# EAGLE schematic proiect (EAGLE 9.6.2)
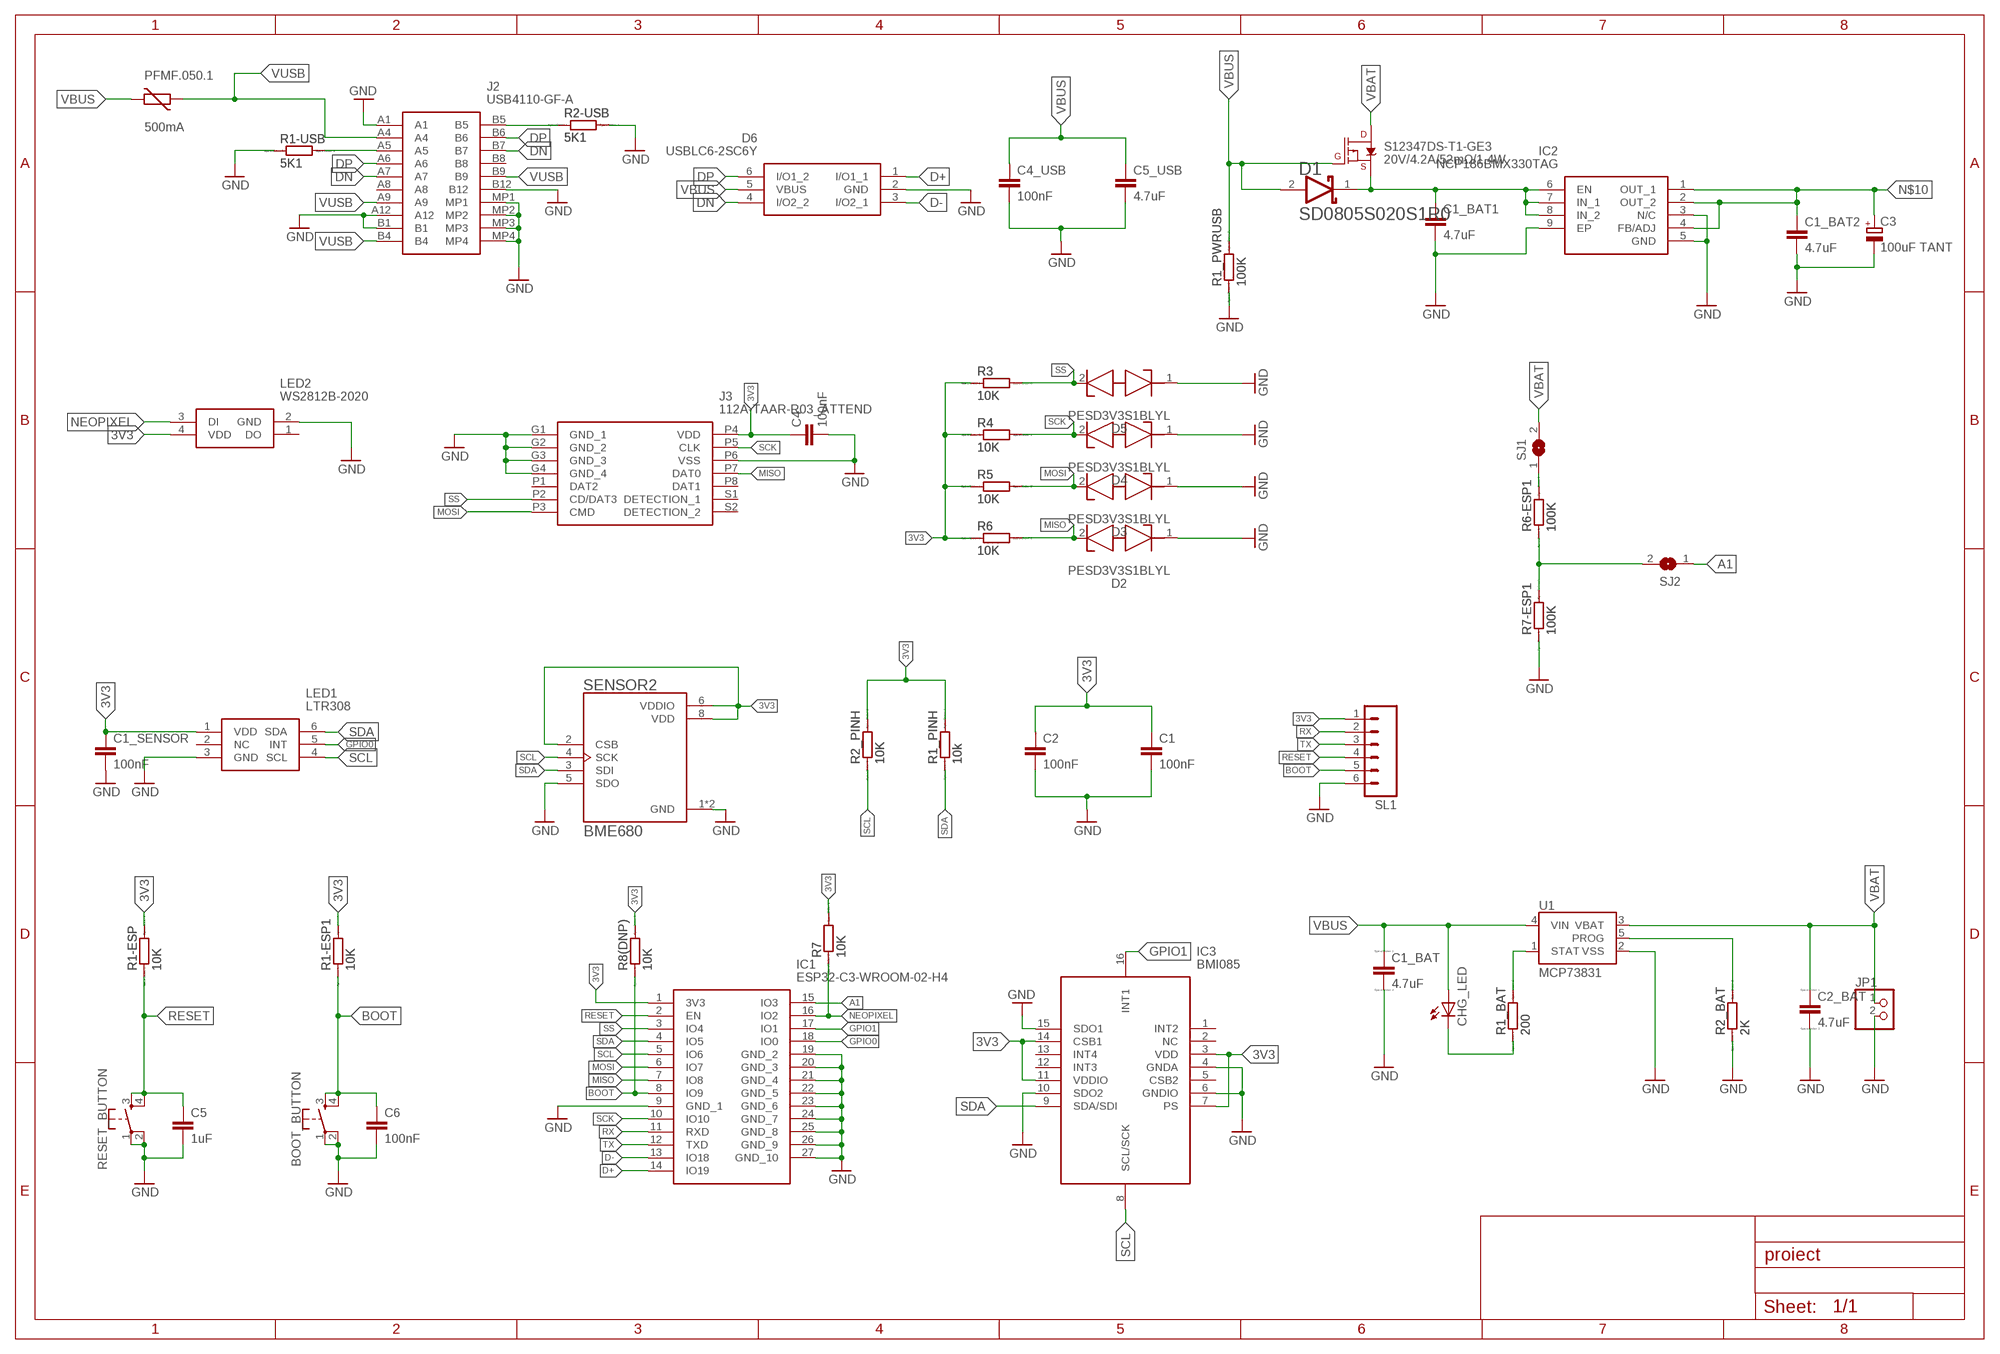
[diagram p0: schematic, sheet 1]

## Parts
BOOT_BUTTON  ESP32_WROVER_SPARKFUN-SWITCHES_MOMENTARY-SWITCH-SPST-2-SMD-4.6X2.8MM  [ESP32_WROVER_SPARKFUN-SWITCHES_TACTILE_SWITCH_SMD_4.6X2.8MM]
C1  100nF  ESP32_WROVER_RCL_C-EUC0603  [ESP32_WROVER_RCL_C0603]
C1_BAT  4.7uF  ESP32_WROVER_EAGLE-LTSPICE_CC0402  [ESP32_WROVER_EAGLE-LTSPICE_C0402]
C1_BAT1  4.7uF  ESP32_WROVER_RCL_C-EUC0603  [ESP32_WROVER_RCL_C0603]
C1_BAT2  4.7uF  ESP32_WROVER_RCL_C-EUC0603  [ESP32_WROVER_RCL_C0603]
C1_SENSOR  100nF  ESP32_WROVER_RCL_C-EUC0603  [ESP32_WROVER_RCL_C0603]
C2  100nF  ESP32_WROVER_RCL_C-EUC0603  [ESP32_WROVER_RCL_C0603]
C2_BAT  4.7uF  ESP32_WROVER_EAGLE-LTSPICE_CC0402  [ESP32_WROVER_EAGLE-LTSPICE_C0402]
C3  100uF TANT  RCL_CPOL-EUCT3528  [RCL_CT3528]
C4  100nF  ESP32_WROVER_RCL_C-EUC0603  [ESP32_WROVER_RCL_C0603]
C4_USB  100nF  ESP32_WROVER_RCL_C-EUC0603  [ESP32_WROVER_RCL_C0603]
C5  1uF  ESP32_WROVER_RCL_C-EUC0603  [ESP32_WROVER_RCL_C0603]
C5_USB  4.7uF  ESP32_WROVER_RCL_C-EUC0603  [ESP32_WROVER_RCL_C0603]
C6  100nF  ESP32_WROVER_RCL_C-EUC0603  [ESP32_WROVER_RCL_C0603]
CHG_LED  ESP32_WROVER_ADAFRUIT_LEDCHIP-LED0603  [ESP32_WROVER_ADAFRUIT_CHIP-LED0603]
D1  ESP32_WROVER_AVX---SD0805S020S1R0_AVX_SD0805S020S1R0AVX_SD0805S020S1R0_0_0  [ESP32_WROVER_AVX---SD0805S020S1R0_AVX_SD0805S020S1R0_0]
D2  PESD3V3S1BLYL  SAMACSYS_PARTS_PESD3V3S1BLYL  [SAMACSYS_PARTS_PESD5V0S1BL315]
D3  PESD3V3S1BLYL  SAMACSYS_PARTS_PESD3V3S1BLYL  [SAMACSYS_PARTS_PESD5V0S1BL315]
D4  PESD3V3S1BLYL  SAMACSYS_PARTS_PESD3V3S1BLYL  [SAMACSYS_PARTS_PESD5V0S1BL315]
D5  PESD3V3S1BLYL  SAMACSYS_PARTS_PESD3V3S1BLYL  [SAMACSYS_PARTS_PESD5V0S1BL315]
D6  USBLC6-2SC6Y  SAMACSYS_PARTS_USBLC6-2SC6Y  [SAMACSYS_PARTS_SOT95P280X145-6N]
IC1  ESP32-C3-WROOM-02-H4  SAMACSYS_PARTS_ESP32-C3-WROOM-02-H4  [SAMACSYS_PARTS_ESP32C3WROOM02H4]
IC2  NCP186BMX330TAG  SAMACSYS_PARTS_NCP186BMX330TAG  [SAMACSYS_PARTS_NCP186AMX330TAG]
IC3  BMI085  SAMACSYS_PARTS_BMI085  [SAMACSYS_PARTS_BMI085]
J2  USB4110-GF-A  SAMACSYS_PARTS_USB4110-GF-A  [SAMACSYS_PARTS_USB4110GFA]
J3  112A-TAAR-R03_ATTEND  SAMACSYS_PARTS_112A-TAAR-R03_ATTEND  [SAMACSYS_PARTS_112ATAARR03ATTEND]
JP1  PINHEAD_PINHD-1X2  [PINHEAD_1X02]
LED1  LTR308  ESP32_WROVER_SAMACSYS_PARTS_LTR-303ALS-01  [ESP32_WROVER_SAMACSYS_PARTS_LTR303ALS01]
LED2  WS2812B-2020  SAMACSYS_PARTS_WS2812B-2020  [SAMACSYS_PARTS_WS2812B2020]
PFMF.050.1  500mA  ESP32_WROVER_VARISTOR_VARISTORCN1812  [ESP32_WROVER_VARISTOR_CT/CN1812]
R1-ESP  10K  ESP32_WROVER_EAGLE-LTSPICE_RR0402  [ESP32_WROVER_EAGLE-LTSPICE_R0402]
R1-ESP1  10K  ESP32_WROVER_EAGLE-LTSPICE_RR0402  [ESP32_WROVER_EAGLE-LTSPICE_R0402]
R1-USB  5K1  ESP32_WROVER_EAGLE-LTSPICE_RR0402  [ESP32_WROVER_EAGLE-LTSPICE_R0402]
R1_BAT  200  ESP32_WROVER_EAGLE-LTSPICE_RR0402  [ESP32_WROVER_EAGLE-LTSPICE_R0402]
R1_PINH  10k  ESP32_WROVER_EAGLE-LTSPICE_RR0402  [ESP32_WROVER_EAGLE-LTSPICE_R0402]
R1_PWRUSB  100K  ESP32_WROVER_EAGLE-LTSPICE_RR0402  [ESP32_WROVER_EAGLE-LTSPICE_R0402]
R2-USB  5K1  ESP32_WROVER_EAGLE-LTSPICE_RR0402  [ESP32_WROVER_EAGLE-LTSPICE_R0402]
R2_BAT  2K  ESP32_WROVER_EAGLE-LTSPICE_RR0402  [ESP32_WROVER_EAGLE-LTSPICE_R0402]
R2_PINH  10K  ESP32_WROVER_EAGLE-LTSPICE_RR0402  [ESP32_WROVER_EAGLE-LTSPICE_R0402]
R3  10K  ESP32_WROVER_EAGLE-LTSPICE_RR0402  [ESP32_WROVER_EAGLE-LTSPICE_R0402]
R4  10K  ESP32_WROVER_EAGLE-LTSPICE_RR0402  [ESP32_WROVER_EAGLE-LTSPICE_R0402]
R5  10K  ESP32_WROVER_EAGLE-LTSPICE_RR0402  [ESP32_WROVER_EAGLE-LTSPICE_R0402]
R6  10K  ESP32_WROVER_EAGLE-LTSPICE_RR0402  [ESP32_WROVER_EAGLE-LTSPICE_R0402]
R6-ESP1  100K  ESP32_WROVER_EAGLE-LTSPICE_RR0402  [ESP32_WROVER_EAGLE-LTSPICE_R0402]
R7  10K  ESP32_WROVER_EAGLE-LTSPICE_RR0402  [ESP32_WROVER_EAGLE-LTSPICE_R0402]
R7-ESP1  100K  ESP32_WROVER_EAGLE-LTSPICE_RR0402  [ESP32_WROVER_EAGLE-LTSPICE_R0402]
R8(DNP)  10K  ESP32_WROVER_EAGLE-LTSPICE_RR0402  [ESP32_WROVER_EAGLE-LTSPICE_R0402]
RESET_BUTTON  ESP32_WROVER_SPARKFUN-SWITCHES_MOMENTARY-SWITCH-SPST-2-SMD-4.6X2.8MM  [ESP32_WROVER_SPARKFUN-SWITCHES_TACTILE_SWITCH_SMD_4.6X2.8MM]
S12347DS-T1-GE3  20V/4.2A/52mΩ/1.4W  ESP32_WROVER_SPARKFUN-DISCRETESEMI_MOSFET_PCH-DMG2305UX-7  [ESP32_WROVER_SPARKFUN-DISCRETESEMI_SOT23-3]
SENSOR2  BME680  ESP32_WROVER_BME680_BME680  [ESP32_WROVER_BME680_PSON80P300X300X100-8N]
SJ1  JUMPER_SJ  [JUMPER_SJ]
SJ2  JUMPER_SJ  [JUMPER_SJ]
SL1  MA06  [06PA]
U1  MCP73831  ESP32_WROVER_SPARKFUN-IC-POWER_MCP73831  [ESP32_WROVER_SPARKFUN-IC-POWER_SOT23-5]

## Nets
3V3: C1.1 C1_SENSOR.1 C2.1 C4.1 IC1.1(3V3) IC3.3(VDD) IC3.7(PS) IC3.11(VDDIO) IC3.14(CSB1) J3.P4(VDD) LED1.1(VDD) LED2.4(VDD) R1-ESP1.2 R1-ESP.2 R1_PINH.2 R2_PINH.2 R3.1 R4.1 R5.1 R6.1 R7.2 R8(DNP).2 SENSOR2.2(CSB) SENSOR2.6(VDDIO) SENSOR2.8(VDD) SL1.1
A1: IC1.15(IO3) SJ2.1
BOOT: BOOT_BUTTON.3 BOOT_BUTTON.4 C6.1 IC1.8(IO9) R1-ESP1.1 R8(DNP).1 SL1.5
D+: D6.1(I/O1_1) IC1.14(IO19)
D-: D6.3(I/O2_1) IC1.13(IO18)
DN: D6.4(I/O2_2) J2.A7 J2.B7
DP: D6.6(I/O1_2) J2.A6 J2.B6
GND: BOOT_BUTTON.1 BOOT_BUTTON.2 C1.2 C1_BAT1.2 C1_BAT2.2 C1_BAT.2 C1_SENSOR.2 C2.2 C2_BAT.2 C3.- C4.2 C4_USB.2 C5.2 C5_USB.2 C6.2 D2.1(K1) D3.1(K1) D4.1(K1) D5.1(K1) D6.2(GND) IC1.9(GND_1) IC1.19(GND_2) IC1.20(GND_3) IC1.21(GND_4) IC1.22(GND_5) IC1.23(GND_6) IC1.24(GND_7) IC1.25(GND_8) IC1.26(GND_9) IC1.27(GND_10) IC2.3(N/C) IC2.5(GND) IC2.9(EP) IC3.4(GNDA) IC3.6(GNDIO) IC3.10(SDO2) IC3.15(SDO1) J2.A1 J2.A12 J2.B1 J2.B12 J2.MP1 J2.MP2 J2.MP3 J2.MP4 J3.G1(GND_1) J3.G2(GND_2) J3.G3(GND_3) J3.G4(GND_4) J3.P6(VSS) JP1.2 LED1.3(GND) LED2.2(GND) R1-USB.1 R1_PWRUSB.1 R2-USB.2 R2_BAT.1 R7-ESP1.1 RESET_BUTTON.1 RESET_BUTTON.2 SENSOR2.1(GND) SENSOR2.5(SDO) SENSOR2.7(GND) SL1.6 U1.2(VSS)
GPIO0: IC1.18(IO0) LED1.5(INT)
GPIO1: IC1.17(IO1) IC3.16(INT1)
MISO: D2.2(K2) IC1.7(IO8) J3.P7(DAT0) R6.2
MOSI: D3.2(K2) IC1.6(IO7) J3.P3(CMD) R5.2
N$1: C1_BAT1.1 D1.1(CATHODE) IC2.6(EN) IC2.7(IN_1) IC2.8(IN_2) S12347DS-T1-GE3.2(S)
N$2: R2_BAT.2 U1.5(PROG)
N$3: R1_BAT.2 U1.1(STAT)
N$4: J2.B5 R2-USB.1
N$5: R6-ESP1.2 SJ1.1
N$6: J2.A5 R1-USB.2
N$7: R6-ESP1.1 R7-ESP1.2 SJ2.2
N$8: CHG_LED.C R1_BAT.1
N$10: C1_BAT2.1 C3.+ IC2.1(OUT_1) IC2.2(OUT_2) IC2.4(FB/ADJ)
NEOPIXEL: IC1.16(IO2) LED2.3(DI) R7.1
RESET: C5.1 IC1.2(EN) R1-ESP.1 RESET_BUTTON.3 RESET_BUTTON.4 SL1.4
RX: IC1.11(RXD) SL1.2
SCK: D4.2(K2) IC1.10(IO10) J3.P5(CLK) R4.2
SCL: IC1.5(IO6) IC3.8(SCL/SCK) LED1.4(SCL) R2_PINH.1 SENSOR2.4(SCK)
SDA: IC1.4(IO5) IC3.9(SDA/SDI) LED1.6(SDA) R1_PINH.1 SENSOR2.3(SDI)
SS: D5.2(K2) IC1.3(IO4) J3.P2(CD/DAT3) R3.2
TX: IC1.12(TXD) SL1.3
VBAT: C2_BAT.1 JP1.1 S12347DS-T1-GE3.3(D) SJ1.2 U1.3(VBAT)
VBUS: C1_BAT.1 C4_USB.1 C5_USB.1 CHG_LED.A D1.2(ANODE) D6.5(VBUS) PFMF.050.1.2 R1_PWRUSB.2 S12347DS-T1-GE3.1(G) U1.4(VIN)
VUSB: J2.A4 J2.A9 J2.B4 J2.B9 PFMF.050.1.1
Unconnected: IC3.1(INT2) IC3.2(NC) IC3.5(CSB2) IC3.12(INT3) IC3.13(INT4) J2.A8 J2.B8 J3.P1(DAT2) J3.P8(DAT1) J3.S1(DETECTION_1) J3.S2(DETECTION_2) LED1.2(NC) LED2.1(DO)

## Library data of the parts
BOOT_BUTTON RESET_BUTTON = ESP32_C3_Sparrow:ESP32_WROVER_SPARKFUN-SWITCHES_MOMENTARY-SWITCH-SPST-2: Momentary Switch (Pushbutton) - SPST - Two Circuits Normally-open (NO) SPST momentary switches (buttons, pushbuttons). Schematic symbol includes two switch circuits. Variants SMD-4.6MMX2.8MM - 4.60mm x 2.80mm Tactile Momentary Button Switch - Used on SparkFun SAMD21 Mini Breakout <https://www.sparkfun.com/products/13664> SMD-5.2MM - Mini Pushbutton Switch - SMD <https://www.sparkfun.com/products/8720> - Used on Arduino Pro Mini <https://www.sparkfun.com/products/11114>; PROD_ID: SWCH-14139; SF_SKU: COM-08720
C1 C1_BAT1 C1_BAT2 C1_SENSOR C2 C4 C4_USB C5 C5_USB C6 = ESP32_C3_Sparrow:ESP32_WROVER_RCL_C-EU: CAPACITOR, European symbol; SPICEPREFIX: C
C1_BAT C2_BAT = ESP32_C3_Sparrow:ESP32_WROVER_EAGLE-LTSPICE_C: CAPACITOR, European symbol; SPICEMODEL: NONE; SPICEPREFIX: C
C3 = ESP32_C3_Sparrow:RCL_CPOL-EU: POLARIZED CAPACITOR, European symbol; SPICEPREFIX: C
CHG_LED = ESP32_C3_Sparrow:ESP32_WROVER_ADAFRUIT_LED: LED OSRAM: - CHIPLED LG R971, LG N971, LY N971, LG Q971, LY Q971, LO R971, LY R971 LH N974, LH R974 LS Q976, LO Q976, LY Q976 LO Q996 - Hyper CHIPLED LW Q18S LB Q993, LB Q99A, LB R99A - SideLED LS A670, LO A670, LY A670, LG A670, LP A670 LB A673, LV A673, LT A673, LW A673 LH A674 LY A675 LS A676, LA A676, LO A676, LY A676, LW A676 LS A679, LY A679, LG A679 - Hyper Micro SIDELED® LS Y876, LA Y876, LO Y876, LY Y876 LT Y87S - SmartLED LW L88C, LW L88S LB L89C, LB L89S, LG L890 LS L89K, LO L89K, LY L89K LS L896, LA L896, LO L896, LY L896 - TOPLED LS T670, LO T670, LY T670, LG T670, LP T670 LSG T670, LSP T670, LSY T670, LOP T670, LYG T670 LG T671, LOG T671, LSG T671 LB T673, LV T673, LT T673, LW T673 LH T674 LS T676, LA T676, LO T676, LY T676, LB T676, LH T676, LSB T676, LW T676 LB T67C, LV T67C, LT T67C, LS T67K, LO T67K, LY T67K, LW E67C LS E67B, LA E67B, LO E67B, LY E67B, LB E67C, LV E67C, LT E67C LW T67C LS T679, LY T679, LG T679 LS T770, LO T770, LY T770, LG T770, LP T770 LB T773, LV T773, LT T773, LW T773 LH T774 LS E675, LA E675, LY E675, LS T675 LS T776, LA T776, LO T776, LY T776, LB T776 LHGB T686 LT T68C, LB T68C - Hyper Mini TOPLED® LB M676 - Mini TOPLED Santana® LG M470 LS M47K, LO M47K, LY M47K Source: http://www.osram.convergy.de/
D1 = ESP32_C3_Sparrow:ESP32_WROVER_AVX---SD0805S020S1R0_AVX_SD0805S020S1R0: Schottky Barrier Rectifier Diode; CENTROID_NOT_SPECIFIED: No; DATASHEET: http://datasheets.avx.com/schottky.pdf; DIGIKEY_DESCRIPTION: DIODE SCHOTTKY 20V 1A 0805; DIGIKEY_PART_NUMBER: 478-7800-1-ND; LEAD_FREE: yes; MF: AVX; MOUSER_PART_NUMBER: 581-SD0805S020S1R0; MPN: SD0805S020S1R0; PACKAGE: 0805 (2012 metric); PREFIX: D; ROHS: yes; TEMPERATURE_RANGE_HIGH: +125°C; TEMPERATURE_RANGE_LOW: -55°C
D2-D5 = ESP32_C3_Sparrow:SAMACSYS_PARTS_PESD3V3S1BLYL: PESD3V3S1BL - Low capacitance bidirectional ESD protection diode Source: Datasheet <https://assets.nexperia.com/documents/data-sheet/PESD3V3S1BL.pdf>; ARROW_PART_NUMBER: PESD3V3S1BLYL; ARROW_PRICE-STOCK: https://www.arrow.com/en/products/pesd3v3s1blyl/nexperia?region=nac; DESCRIPTION: PESD3V3S1BL - Low capacitance bidirectional ESD protection diode; HEIGHT: 0mm; MANUFACTURER_NAME: Nexperia; MANUFACTURER_PART_NUMBER: PESD3V3S1BLYL; MOUSER_PART_NUMBER: 771-PESD3V3S1BLYL; MOUSER_PRICE-STOCK: https://www.mouser.co.uk/ProductDetail/Nexperia/PESD3V3S1BLYL?qs=vLWxofP3U2zWoKHYJMVoKQ%3D%3D
D6 = ESP32_C3_Sparrow:SAMACSYS_PARTS_USBLC6-2SC6Y: Low Cap. ESD Protection Auto SOT-23-6 STMicroelectronics USBLC6-2SC6Y, Dual Uni-Directional TVS Diode Array, 6-Pin SOT-23 Source: Datasheet <https://componentsearchengine.com/Datasheets/1/USBLC6-2SC6Y.pdf>; ARROW_PART_NUMBER: USBLC6-2SC6Y; ARROW_PRICE-STOCK: https://www.arrow.com/en/products/usblc6-2sc6y/stmicroelectronics?region=nac; DESCRIPTION: Low Cap. ESD Protection Auto SOT-23-6 STMicroelectronics USBLC6-2SC6Y, Dual Uni-Directional TVS Diode Array, 6-Pin SOT-23; HEIGHT: 1.45mm; MANUFACTURER_NAME: STMicroelectronics; MANUFACTURER_PART_NUMBER: USBLC6-2SC6Y; MOUSER_PART_NUMBER: 511-USBLC6-2SC6Y; MOUSER_PRICE-STOCK: https://www.mouser.co.uk/ProductDetail/STMicroelectronics/USBLC6-2SC6Y?qs=gNDSiZmRJS%2FOgDexvXkdow%3D%3D
IC1 = ESP32_C3_Sparrow:SAMACSYS_PARTS_ESP32-C3-WROOM-02-H4: WiFi Modules (802.11) SMD module, ESP32-C3, 4MB SPI flash, PCB antenna, -40 C +105 C Source: Datasheet <https://www.mouser.in/datasheet/2/891/Espressif_Systems_04082021_ESP32_C3_WROOM_02-2295851.pdf>; DESCRIPTION: WiFi Modules (802.11) SMD module, ESP32-C3, 4MB SPI flash, PCB antenna, -40 C +105 C; HEIGHT: 3.35mm; MANUFACTURER_NAME: Espressif Systems; MANUFACTURER_PART_NUMBER: ESP32-C3-WROOM-02-H4; MOUSER_PART_NUMBER: 356-ESP32C3WROOM02H4; MOUSER_PRICE-STOCK: https://www.mouser.co.uk/ProductDetail/Espressif-Systems/ESP32-C3-WROOM-02-H4?qs=stqOd1AaK79%2FSA14oWtR%252Bw%3D%3D
IC2 = ESP32_C3_Sparrow:SAMACSYS_PARTS_NCP186BMX330TAG: LDO Voltage Regulators FAST TRANSIENT RESPO Source: Datasheet <http://www.onsemi.com/pub/Collateral/NCP186-D.PDF>; ARROW_PART_NUMBER: NCP186BMX330TAG; ARROW_PRICE-STOCK: https://www.arrow.com/en/products/ncp186bmx330tag/on-semiconductor?region=nac; DESCRIPTION: LDO Voltage Regulators FAST TRANSIENT RESPO; HEIGHT: mm; MANUFACTURER_NAME: onsemi; MANUFACTURER_PART_NUMBER: NCP186BMX330TAG; MOUSER_PART_NUMBER: 863-NCP186BMX330TAG; MOUSER_PRICE-STOCK: https://www.mouser.co.uk/ProductDetail/onsemi/NCP186BMX330TAG?qs=tCMd4XlZ%2FiDuLBXmI4EY0w%3D%3D
IC3 = ESP32_C3_Sparrow:SAMACSYS_PARTS_BMI085: IMUs - Inertial Measurement Units High-performance IMU BMI085 for virtual and augmented reality applications Source: Datasheet <https://ae-bst.resource.bosch.com/media/_tech/media/datasheets/BST-BMI085-DS001.pdf>; ARROW_PART_NUMBER: BMI085; ARROW_PRICE-STOCK: https://www.arrow.com/en/products/bmi085/bosch; DESCRIPTION: IMUs - Inertial Measurement Units High-performance IMU BMI085 for virtual and augmented reality applications; HEIGHT: 1mm; MANUFACTURER_NAME: BOSCH; MANUFACTURER_PART_NUMBER: BMI085; MOUSER_PART_NUMBER: 262-BMI085; MOUSER_PRICE-STOCK: https://www.mouser.co.uk/ProductDetail/Bosch-Sensortec/BMI085?qs=y6ZabgHbY%252ByGCM8LfWZyqA%3D%3D
J2 = ESP32_C3_Sparrow:SAMACSYS_PARTS_USB4110-GF-A: CONN USB 2.0 TYPE-C R/A SMT Source: Datasheet <https://gct.co/files/drawings/usb4110.pdf>; DESCRIPTION: CONN USB 2.0 TYPE-C R/A SMT; HEIGHT: 3.26mm; MANUFACTURER_NAME: GCT (GLOBAL CONNECTOR TECHNOLOGY); MANUFACTURER_PART_NUMBER: USB4110-GF-A; MOUSER_PART_NUMBER: 640-USB4110-GF-A; MOUSER_PRICE-STOCK: https://www.mouser.co.uk/ProductDetail/GCT/USB4110-GF-A?qs=KUoIvG%2F9IlYiZvIXQjyJeA%3D%3D
J3 = ESP32_C3_Sparrow:SAMACSYS_PARTS_112A-TAAR-R03_ATTEND: Micro SD Card Socket, Push-Push Type, Top Mount, SMT, H=1.83mm, 10u Source: Datasheet <https://www.attend.com.tw/data/download/file/112A-TAAR-R03.pdf>; DESCRIPTION: Micro SD Card Socket, Push-Push Type, Top Mount, SMT, H=1.83mm, 10u; HEIGHT: 1.9mm; MANUFACTURER_NAME: ATTEND; MANUFACTURER_PART_NUMBER: 112A-TAAR-R03 ATTEND
JP1 = ESP32_C3_Sparrow:PINHEAD_PINHD-1X2: PIN HEADER
LED1 = ESP32_C3_Sparrow:ESP32_WROVER_SAMACSYS_PARTS_LTR-303ALS-01: Ambient Light Sensors Ambient Light Photo Sensor Source: Datasheet <http://optoelectronics.liteon.com/upload/download/DS86-2013-0004/LTR-303ALS-01_DS_V1.pdf>; ARROW_PART_NUMBER: LTR-303ALS-01; ARROW_PRICE-STOCK: https://www.arrow.com/en/products/ltr-303als-01/lite-on-technology?region=nac; DESCRIPTION: Ambient Light Sensors Ambient Light Photo Sensor; HEIGHT: 0mm; MANUFACTURER_NAME: Lite-On; MANUFACTURER_PART_NUMBER: LTR-303ALS-01; MOUSER_PART_NUMBER: 859-LTR-303ALS-01; MOUSER_PRICE-STOCK: https://www.mouser.co.uk/ProductDetail/Lite-On/LTR-303ALS-01?qs=Ml%2FaxAEbwm%252Bm%252BetMkBDC8g%3D%3D
LED2 = ESP32_C3_Sparrow:SAMACSYS_PARTS_WS2812B-2020: LED; SMD; 2020; RGB; 2x2x0.84mm; 3.75.3V; Lens: transparent; 2kHz Source: Datasheet <https://www.alldatasheet.com/datasheet-pdf/pdf/1134522/WORLDSEMI/WS2812B-2020.html>; DESCRIPTION: LED; SMD; 2020; RGB; 2x2x0.84mm; 3.75.3V; Lens: transparent; 2kHz; HEIGHT: 0.84mm; MANUFACTURER_NAME: Worldsemi; MANUFACTURER_PART_NUMBER: WS2812B-2020
PFMF.050.1 = ESP32_C3_Sparrow:ESP32_WROVER_VARISTOR_VARISTOR: VARISTOR
R1-ESP R1-ESP1 R1-USB R1_BAT R1_PINH R1_PWRUSB R2-USB R2_BAT R2_PINH R3-R6 R6-ESP1 R7 R7-ESP1 R8(DNP) = ESP32_C3_Sparrow:ESP32_WROVER_EAGLE-LTSPICE_R: RESISTOR, European symbol; SPICEMODEL: NONE; SPICEPREFIX: R
S12347DS-T1-GE3 = ESP32_C3_Sparrow:ESP32_WROVER_SPARKFUN-DISCRETESEMI_MOSFET_PCH: P-channel MOSFETs Voltage controlled devices that allow control of high current outputs. SparkFun Products: SparkFun ESP32 Thing <https://www.sparkfun.com/products/13907> SparkFun ESP8266 Thing <https://www.sparkfun.com/products/13231> SparkFun Pi Servo HAT V2 <https://www.sparkfun.com/products/15316> DMG2305UX-7 (20V/4.2A/SOT23-3); PROD_ID: TRAN-14388
SENSOR2 = ESP32_C3_Sparrow:ESP32_WROVER_BME680_BME680: Integrated Environmental Unit; AVAILABILITY: Unavailable; DESCRIPTION: Integrated Environmental Unit; MF: Bosch Sensortec; MP: BME680; PACKAGE: LGA-8 Bosch Tools; PRICE: None
SJ1 SJ2 = ESP32_C3_Sparrow:JUMPER_SJ: SMD solder JUMPER
SL1 = con-amp-quick:MA06: AMP QUICK CONNECTOR; OC_FARNELL: unknown; OC_NEWARK: unknown
U1 = ESP32_C3_Sparrow:ESP32_WROVER_SPARKFUN-IC-POWER_MCP73831: MCP73831T Li-Ion, Li-Pol Controller Miniature single cell, fully integrated Li-Ion, Li-polymer charge management controller Datasheet <http://ww1.microchip.com/downloads/en/DeviceDoc/20001984g.pdf> SparkFun Products: SparkFun ESP32 Thing <https://www.sparkfun.com/products/13907> SparkFun 9DoF Razor IMU M0 <https://www.sparkfun.com/products/14001>; PROD_ID: IC-09995